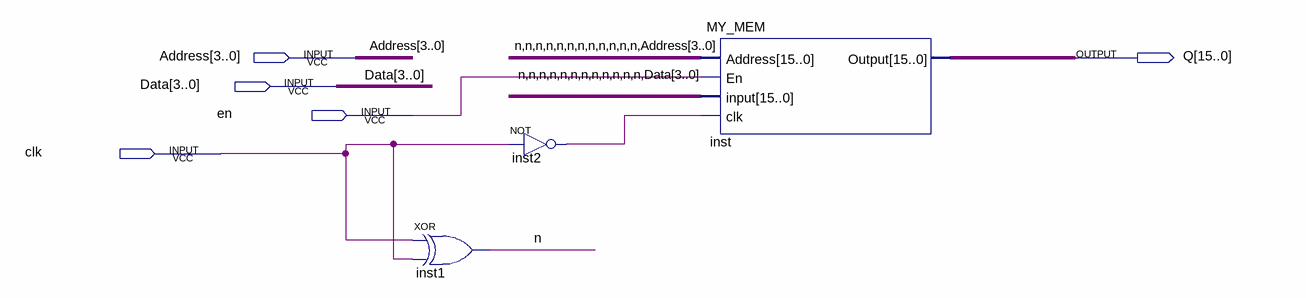
[diagram p0: schematic sheet]
// Quartus schematic test_MYMEM.bdf as structural Verilog: 3 symbols, 5 pins
module test_MYMEM (
  input  [3:0] Address,
  input  [3:0] Data,
  input  en,
  input  clk,
  output [15:0] Q
);

  wire inst2_out, n;

  xor inst1 (n, clk, clk);
  not inst2 (inst2_out, clk);
  MY_MEM inst (.Address({{12{n}}, Address}), .En(en), .\input ({{12{n}}, Data}), .clk(inst2_out), .Output(Q));
endmodule
